# Altium schematic sheet MCU.SchDoc
size 254 x 203 mm; Author: Aurimas Vilkas; DrawnBy: Aurimas Vilkas; Engineer: Aurimas Vilkas
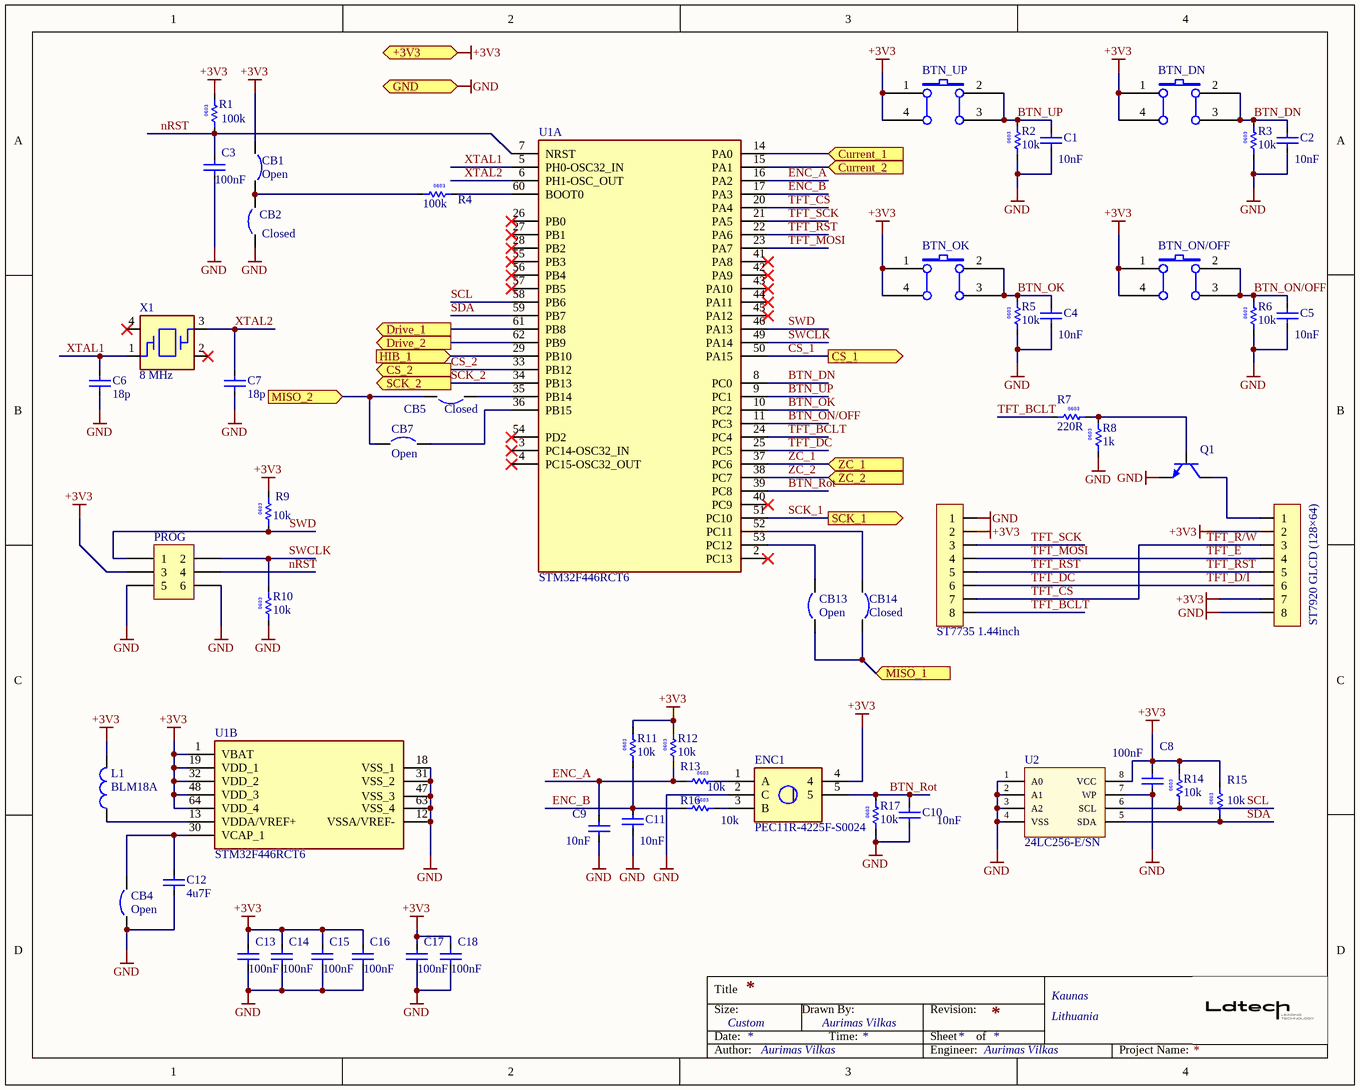
[diagram p0: MCU.SchDoc]

## Parts
BTN_DN  Button  [PB-6X6mm]  (value not drawn)
BTN_OK  Button  [PB-6X6mm]  (value not drawn)
BTN_ON/OFF  Button  [PB-6X6mm]  (value not drawn)
BTN_UP  Button  [PB-6X6mm]  (value not drawn)
C1  10nF  [CAPC1608N]
C2  10nF  [CAPC1608N]
C3  100nF  [CAPC1608N]
C4  10nF  [CAPC1608N]
C5  10nF  [CAPC1608N]
C6  18p  [CAPC1608N]
C7  18p  [CAPC1608N]
C8  100nF  [CAPC1608N]
C9  10nF  [CAPC1608N]
C10  10nF  [CAPC1608N]
C11  10nF  [CAPC1608N]
C12  4u7F  [CAPC1608N]
C13  100nF  [CAPC1608N]
C14  100nF  [CAPC1608N]
C15  100nF  [CAPC1608N]
C16  100nF  [CAPC1608N]
C17  100nF  [CAPC1608N]
C18  100nF  [CAPC1608N]
CB1  Open  [CB_0603]
CB2  Closed  [CB_0603]
CB4  Open  [CB_0603]
CB5  Closed  [CB_0603]
CB7  Open  [CB_0603]
CB13  Open  [CB_0603]
CB14  Closed  [CB_0603]
ENC1  PEC11R-4225F-S0024  [PEC12R-4XXXF-SXXXX_1]
L1  BLM18A  [0603L]
PROG  PROG  [B6B_SMT]  (value not drawn)
Q1  FMMT493ATA  [SOT23-3]  (value not drawn)
R1  100k  [RESC1608N]
R2  10k  [RESC1608N]
R3  10k  [RESC1608N]
R4  100k  [RESC1608N]
R5  10k  [RESC1608N]
R6  10k  [RESC1608N]
R7  220R  [RESC1608N]
R8  1k  [RESC1608N]
R9  10k  [RESC1608N]
R10  10k  [RESC1608N]
R11  10k  [RESC1608N]
R12  10k  [RESC1608N]
R13  10k  [RESC1608N]
R14  10k  [RESC1608N]
R15  10k  [RESC1608N]
R16  10k  [RESC1608N]
R17  10k  [RESC1608N]
ST7735_1.44inch  ST7735 1.44inch  [B8B-XH-A (LF)(SN)]  (value not drawn)
ST7920_GLCD_(128×64)  ST7920 GLCD (128×64)  [B8B-XH-A (LF)(SN)]  (value not drawn)
U1  STM32F446RCT6  [LQFP-64N]  (parts A,B of 2)
U2  24LC256-E/SN  [SOIC-8]
X1  8 MHz  [2SMX-3SMXB]

## Ports
+3V3 (in), CS_1 (out), CS_2 (out), Current_1 (in), Current_2 (in), Drive_1 (out), Drive_2 (out), GND (bidir), HIB_1 (in), MISO_1 (in), MISO_2 (in), SCK_1 (out), SCK_2 (out), ZC_1 (in), ZC_2 (in)

## Nets
+3V3: BTN_DN.1(A0) BTN_DN.4(A1) BTN_OK.1(A0) BTN_OK.4(A1) BTN_ON/OFF.1(A0) BTN_ON/OFF.4(A1) BTN_UP.1(A0) BTN_UP.4(A1) C8.2 C13.2 C14.2 C15.2 C16.2 C17.2 C18.2 CB1.1 ENC1.4 L1.2 PROG.3 R1.2 R9.2 R11.2 R12.2 R14.2 R15.2 ST7735_1.44inch.2 ST7920_GLCD_(128×64).2 ST7920_GLCD_(128×64).7 U1.1(VBAT) U1.19(VDD_1) U1.32(VDD_2) U1.48(VDD_3) U1.64(VDD_4) U2.8(VCC) ; port +3V3
GND: C1.2 C2.2 C3.1 C4.2 C5.2 C6.1 C7.1 C8.1 C9.2 C10.2 C11.2 C12.1 C13.1 C14.1 C15.1 C16.1 C17.1 C18.1 CB2.1 CB4.1 ENC1.2(C) PROG.5 PROG.6 Q1.2(E) R2.1 R3.1 R5.1 R6.1 R8.1 R10.1 R17.1 ST7735_1.44inch.1 ST7920_GLCD_(128×64).8 U1.12(VSSA/VREF-) U1.18(VSS_1) U1.31(VSS_2) U1.47(VSS_3) U1.63(VSS_4) U2.1(A0) U2.2(A1) U2.3(A2) U2.4(VSS) U2.7(WP) ; port GND
BTN_DN: BTN_DN.2(B0) BTN_DN.3(B1) C2.1 R3.2 U1.8(PC0)
BTN_OK: BTN_OK.2(B0) BTN_OK.3(B1) C4.1 R5.2 U1.10(PC2)
BTN_ON/OFF: BTN_ON/OFF.2(B0) BTN_ON/OFF.3(B1) C5.1 R6.2 U1.11(PC3)
BTN_Rot: C10.1 ENC1.5 R17.2 U1.39(PC8)
BTN_UP: BTN_UP.2(B0) BTN_UP.3(B1) C1.1 R2.2 U1.9(PC1)
CS_1: U1.50(PA15) ; port CS_1
CS_2: U1.33(PB12) ; port CS_2
Current_1: U1.14(PA0) ; port Current_1
Current_2: U1.15(PA1) ; port Current_2
Drive_1: U1.61(PB8) ; port Drive_1
Drive_2: U1.62(PB9) ; port Drive_2
ENC_A: C9.1 R12.1 R13.1 U1.16(PA2)
ENC_B: C11.1 R11.1 R16.1 U1.17(PA3)
HIB_1: U1.29(PB10) ; port HIB_1
MISO_1: CB13.1 CB14.2 ; port MISO_1
MISO_2: CB5.2 CB7.1 ; port MISO_2
nRST: C3.2 PROG.4 R1.1 U1.7(NRST)
SCK_1: U1.51(PC10) ; port SCK_1
SCK_2: U1.34(PB13) ; port SCK_2
SCL: R14.1 U1.58(PB6) U2.6(SCL)
SDA: R15.1 U1.59(PB7) U2.5(SDA)
SWCLK: PROG.2 R10.2 U1.49(PA14)
SWD: PROG.1 R9.1 U1.46(PA13)
TFT_BCLT: R7.1 ST7735_1.44inch.8 U1.24(PC4)
TFT_CS: ST7735_1.44inch.7 ST7920_GLCD_(128×64).3 U1.20(PA4)  [also labelled TFT_R/W]
TFT_D/I: ST7735_1.44inch.6 ST7920_GLCD_(128×64).6 U1.25(PC5)  [also labelled TFT_DC]
TFT_E: ST7735_1.44inch.4 ST7920_GLCD_(128×64).4 U1.23(PA7)  [also labelled TFT_MOSI]
TFT_RST: ST7735_1.44inch.5 ST7920_GLCD_(128×64).5 U1.22(PA6)
TFT_SCK: ST7735_1.44inch.3 U1.21(PA5)
XTAL1: C6.2 U1.5(PH0-OSC32_IN) X1.1
XTAL2: C7.2 U1.6(PH1-OSC_OUT) X1.3
ZC_1: U1.37(PC6) ; port ZC_1
ZC_2: U1.38(PC7) ; port ZC_2
NetC12_2: C12.2 CB4.2 U1.30(VCAP_1)
NetCB1_2: CB1.2 CB2.2 R4.1
NetCB5_1: CB5.1 U1.35(PB14)
NetCB7_2: CB7.2 U1.36(PB15)
NetCB13_2: CB13.2 U1.53(PC12)
NetCB14_1: CB14.1 U1.52(PC11)
NetENC1_1: ENC1.1(A) R13.2
NetENC1_3: ENC1.3(B) R16.2
NetL1_1: L1.1 U1.13(VDDA/VREF+)
NetQ1_1: Q1.1(B) R7.2 R8.2
NetQ1_3: Q1.3(C) ST7920_GLCD_(128×64).1
NetR4_2: R4.2 U1.60(BOOT0)

Not connected (* = marked no-connect by the designer): U1 2(PC13)* 3(PC14-OSC32_IN)* 4(PC15-OSC32_OUT)* 26(PB0)* 27(PB1)* 28(PB2)* 40(PC9)* 41(PA8)* 42(PA9)* 43(PA10)* 44(PA11)* 45(PA12)* 54(PD2)* 55(PB3)* 56(PB4)* 57(PB5)*; X1 2* 4*

## Notes on the sheet
- Title
- Size:
- Date:
- Custom
- Drawn By:
- Time:
- Revision:
- Sheet
- of
- Kaunas
- Lithuania
- Author:
- Engineer:
- Project Name:
- (in symbol R0000008) 0603
- (in symbol R2406056) 0603
- (in symbol R2406120) 0603

## Library data of the parts
BTN_DN BTN_OK BTN_ON/OFF BTN_UP = Tactile PB: FSM2JRT -  Tactile Switch, Non Illuminated, 24 V, 50 mA, 225 gf, PC Pin, FSM Series; Supplier 1: Farnell; Supplier Part Number 1: 2610957
C1 C2 C4 C5 C9-C11 = C0000009: MCU0603R103KCT -  SMD Multilayer Ceramic Capacitor, 10000 pF, 50 V, 0603 [1608 Metric], ± 10%, X7R, MCU Series; Supplier 1: Farnell; Supplier Part Number 1: 9406182
C3 C8 C13-C18 = C0000005: MC0805B104K250CT -  SMD Multilayer Ceramic Capacitor, 0.1 µF, 25 V, 0805 [2012 Metric], ± 10%, X7R, MC Series; Supplier 1: Farnell; Supplier Part Number 1: 1759166
C6 C7 = C0000124: 0603N180J500CT -  SMD Multilayer Ceramic Capacitor, 0603 [1608 Metric], 18 pF, 50 V, ± 5%, C0G / NP0; Supplier 1: Farnell; Supplier Part Number 1: 2496890
C12 = C0000005: CL10A475KQ8NNNC -  SMD Multilayer Ceramic Capacitor, 4.7 µF, 6.3 V, 0603 [1608 Metric], ± 10%, X5R, CL Series; Supplier 1: Farnell; Supplier Part Number 1: 3013399
CB1 CB4 CB7 CB13 = CB Open: Circuit Breaker; Revision: July-2002: Re-released for DXP Platform.
CB2 CB5 CB14 = CB Closed: Circuit Breaker; Revision: July-2002: Re-released for DXP Platform.
ENC1 = PEC11R-4225F-S0024: PEC11R-4225F-S0024 -  Rotary Encoder, Mechanical, Incremental, 24 PPR, 24 Detents, Vertical, With Momentary Push Switch; Supplier Part Number 1: 2381866; Supplier 1: Farnell
L1 = BLM18AG601SN1D: BLM18AG601SN1D -  Ferrite Bead, 0603 [1608 Metric], 600 ohm, 500 mA, BLM18A Series, 0.38 ohm, ± 25%; Supplier 1: Farnell; Supplier Part Number 1: 1515679
PROG = B6B_SMT: 1241050-3 -  Board-To-Board Connector, 2.54 mm, 6 Contacts, Header, AMPMODU MOD II Series, Surface Mount, 2 Rows; Supplier 1: Farnell; Supplier Part Number 1: 9689567
Q1 = FMMT493ATA: FMMT493ATA -  Bipolar (BJT) Single Transistor, NPN, 60 V, 150 MHz, 500 mW, 1 A, 300 hFE; Supplier Part Number 1: 2061448; Supplier 1: Farnell
R1 R4 = R2406120: MCWR06X1003FTL -  SMD Chip Resistor, 0603 [1608 Metric], 100 kohm, MCWR Series, 50 V, Thick Film, 100 mW; Supplier 1: Farnell; Supplier Part Number 1: 2447226RL
R2 R3 R5 R6 R9-R17 = R0000008: MCWR06X1002FTL -  SMD Chip Resistor, 0603 [1608 Metric], 10 kohm, MCWR Series, 50 V, Thick Film, 100 mW; Supplier 1: Farnell; Supplier Part Number 1: 2447230
R7 = R2406056: CRGH0603F220R -  SMD Chip Resistor, 220 ohm, CRG Series, 50 V, Thick Film, 0603 [1608 Metric], 200 mW; Supplier 1: Farnell; Supplier Part Number 1: 2331993
R8 = R2406056: CRGH0603F1K0 -  SMD Chip Resistor, 1 kohm, CRG Series, 50 V, Thick Film, 0603 [1608 Metric], 200 mW; Supplier 1: Farnell; Supplier Part Number 1: 2332003
ST7735_1.44inch ST7920_GLCD_(128×64) = B8B-XH-A: B8B-XH-A (LF)(SN) -  Wire-To-Board Connector, Vertical, 2.5 mm, 8 Contacts, Header, XH Series, Through Hole, 1 Rows; Supplier 1: Farnell; Supplier Part Number 1: 1516284
U1 = STM32F446RCT6TR: STM32F446RCT6 -  ARM MCU, High Performance, STM32 Family STM32F4 Series Microcontrollers, ARM Cortex-M4, 32bit; Kitron: 4110530; Supplier 1: Farnell; Supplier Part Number 1: 2488309
U2 = 24LC256-E/SN: 24LC256-E/SN -  EEPROM, 256 Kbit, 32K x 8bit, Serial I2C (2-Wire), 400 kHz, SOIC, 8 Pins; Supplier Part Number 1: 1579573; Supplier 1: Farnell
X1 = M0000014: CRYSTAL, 8M, 18PF CL, 6X3.6MM SMT; Supplier 1: Farnell; Supplier Part Number 1: 1611803